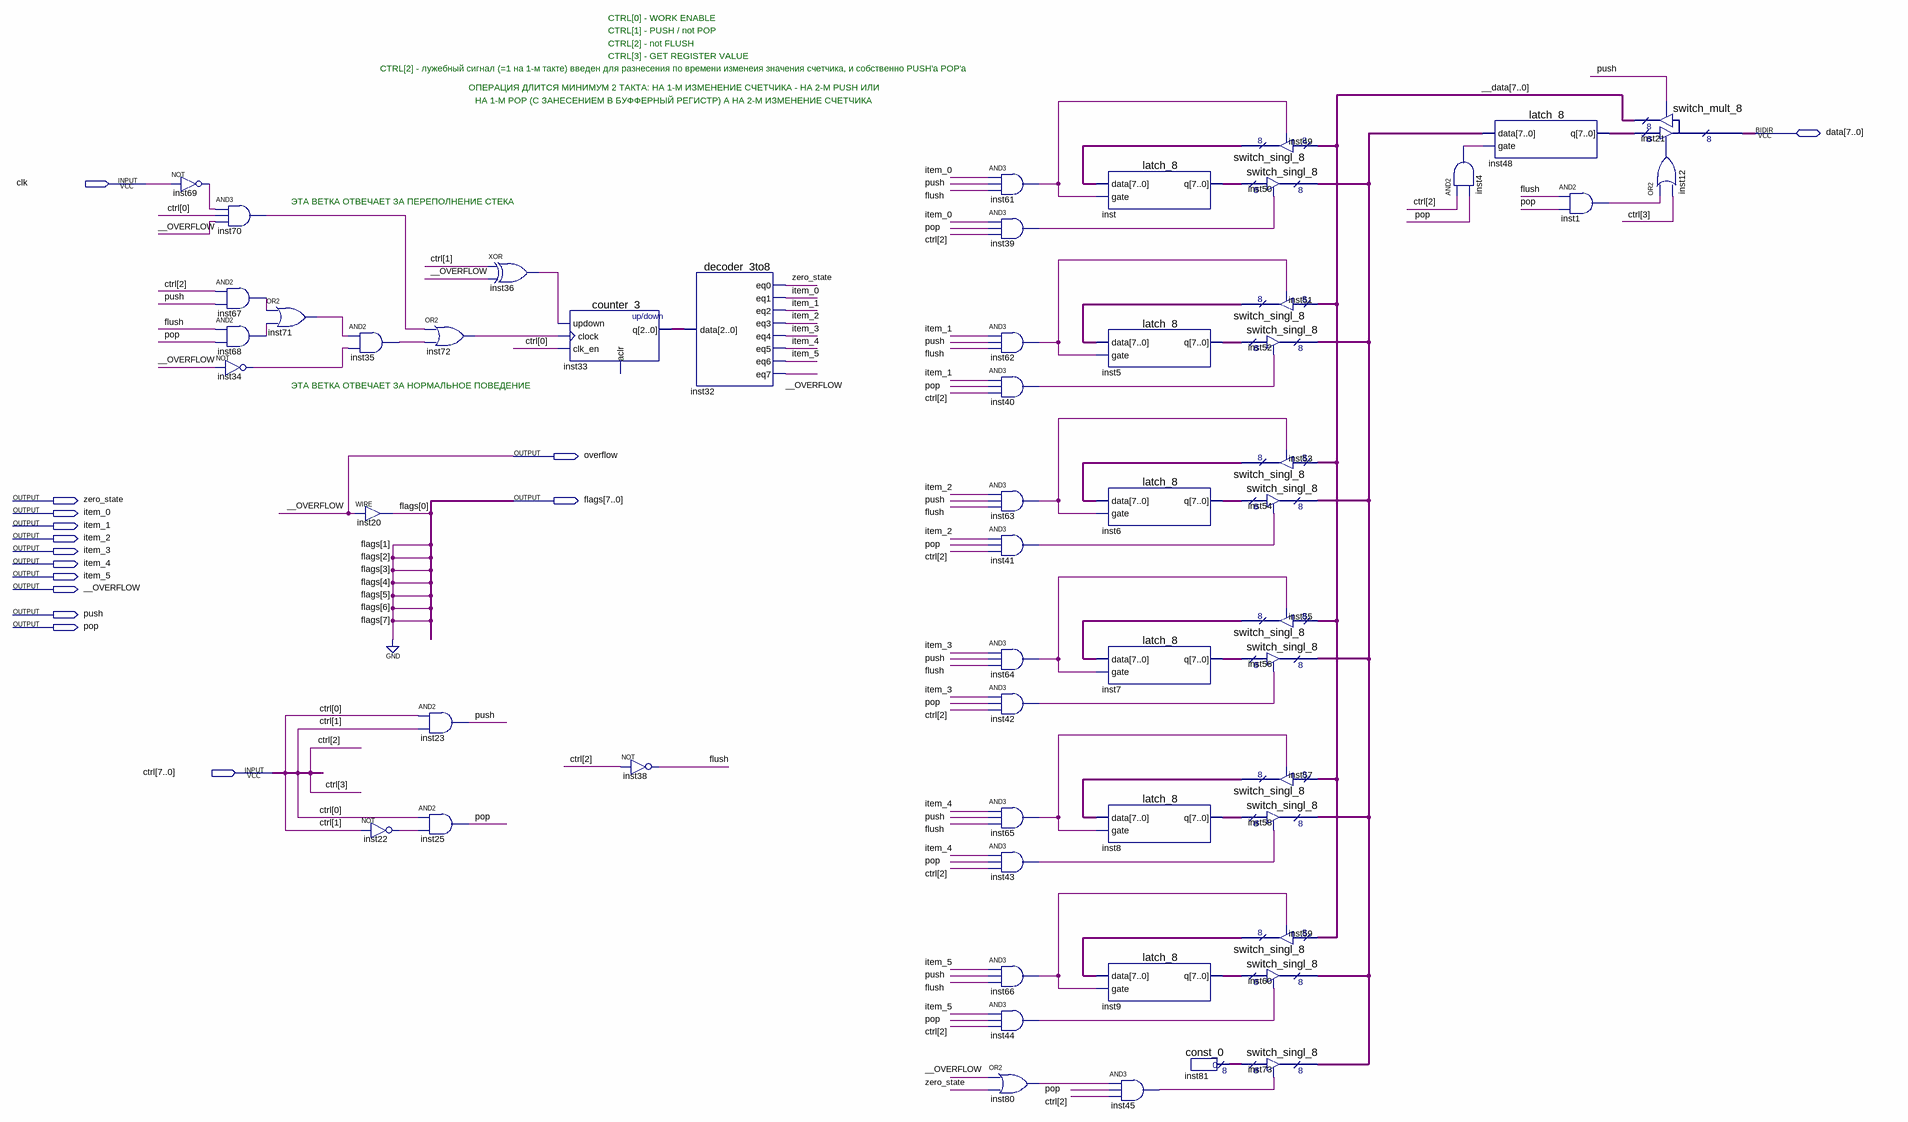
[diagram p0: schematic sheet]
// Quartus schematic stack.bdf as structural Verilog: 55 symbols, 15 pins
module stack (
  input  clk,
  input  [7:0] ctrl,
  inout  [7:0] data,
  output overflow,
  output zero_state,
  output [7:0] flags,
  output item_0,
  output item_1,
  output item_2,
  output item_3,
  output item_4,
  output item_5,
  output __OVERFLOW,
  output push,
  output pop
);

  wire flush, inst1_out, inst4_out, inst12_out, inst22_out, inst34_out, inst35_out, inst36_out, inst39_out,
       inst40_out, inst41_out, inst42_out, inst43_out, inst44_out, inst45_out, inst61_out, inst62_out,
       inst63_out, inst64_out, inst65_out, inst66_out, inst67_out, inst68_out, inst69_out, inst70_out,
       inst71_out, inst72_out, inst80_out;
  wire [2:0] inst33_q;
  wire [7:0] __data, inst5_q, inst6_q, inst7_q, inst8_q, inst9_q, inst48_q, inst49_tridata, inst50_tridata,
       inst51_tridata, inst53_tridata, inst55_tridata, inst57_tridata, inst59_tridata, inst81_result, inst_q;

  not inst69 (inst69_out, clk);
  and inst70 (inst70_out, inst69_out, ctrl[0], __OVERFLOW);
  and inst67 (inst67_out, ctrl[2], push);
  and inst68 (inst68_out, flush, pop);
  not inst34 (inst34_out, __OVERFLOW);
  or inst71 (inst71_out, inst67_out, inst68_out);
  and inst35 (inst35_out, inst71_out, inst34_out);
  assign flags[0] = __OVERFLOW;  // WIRE inst20
  not inst22 (inst22_out, ctrl[1]);
  or inst72 (inst72_out, inst70_out, inst35_out);
  and inst23 (push, ctrl[0], ctrl[1]);
  and inst25 (pop, ctrl[0], inst22_out);
  xor inst36 (inst36_out, ctrl[1], __OVERFLOW);
  counter_3 inst33 (.updown(inst36_out), .clock(inst72_out), .clk_en(ctrl[0]), .q(inst33_q));  // open: aclr
  not inst38 (flush, ctrl[2]);
  decoder_3to8 inst32 (
    .data(inst33_q), .eq0(zero_state), .eq1(item_0), .eq2(item_1), .eq3(item_2), .eq4(item_3), .eq5(item_4),
    .eq6(item_5), .eq7(__OVERFLOW));
  and inst61 (inst61_out, item_0, push, flush);
  and inst39 (inst39_out, item_0, pop, ctrl[2]);
  and inst62 (inst62_out, item_1, push, flush);
  and inst40 (inst40_out, item_1, pop, ctrl[2]);
  and inst63 (inst63_out, item_2, push, flush);
  and inst41 (inst41_out, item_2, pop, ctrl[2]);
  and inst64 (inst64_out, item_3, push, flush);
  and inst42 (inst42_out, item_3, pop, ctrl[2]);
  and inst65 (inst65_out, item_4, push, flush);
  and inst43 (inst43_out, item_4, pop, ctrl[2]);
  and inst66 (inst66_out, item_5, push, flush);
  and inst44 (inst44_out, item_5, pop, ctrl[2]);
  or inst80 (inst80_out, __OVERFLOW, zero_state);
  latch_8 inst (.data(inst49_tridata), .gate(inst61_out), .q(inst_q));
  latch_8 inst5 (.data(inst51_tridata), .gate(inst62_out), .q(inst5_q));
  latch_8 inst6 (.data(inst53_tridata), .gate(inst63_out), .q(inst6_q));
  latch_8 inst7 (.data(inst55_tridata), .gate(inst64_out), .q(inst7_q));
  latch_8 inst8 (.data(inst57_tridata), .gate(inst65_out), .q(inst8_q));
  latch_8 inst9 (.data(inst59_tridata), .gate(inst66_out), .q(inst9_q));
  and inst45 (inst45_out, inst80_out, pop, ctrl[2]);
  const_0 inst81 (.result(inst81_result));
  switch_singl_8 inst49 (.enabledt(inst61_out), .data(__data), .tridata(inst49_tridata));
  switch_singl_8 inst50 (.enabledt(inst39_out), .data(inst_q), .tridata(inst50_tridata));
  switch_singl_8 inst51 (.enabledt(inst62_out), .data(__data), .tridata(inst51_tridata));
  switch_singl_8 inst52 (.enabledt(inst40_out), .data(inst5_q), .tridata(inst50_tridata));
  switch_singl_8 inst53 (.enabledt(inst63_out), .data(__data), .tridata(inst53_tridata));
  switch_singl_8 inst54 (.enabledt(inst41_out), .data(inst6_q), .tridata(inst50_tridata));
  switch_singl_8 inst55 (.enabledt(inst64_out), .data(__data), .tridata(inst55_tridata));
  switch_singl_8 inst56 (.enabledt(inst42_out), .data(inst7_q), .tridata(inst50_tridata));
  switch_singl_8 inst57 (.enabledt(inst65_out), .data(__data), .tridata(inst57_tridata));
  switch_singl_8 inst58 (.enabledt(inst43_out), .data(inst8_q), .tridata(inst50_tridata));
  switch_singl_8 inst59 (.enabledt(inst66_out), .data(__data), .tridata(inst59_tridata));
  switch_singl_8 inst60 (.enabledt(inst44_out), .data(inst9_q), .tridata(inst50_tridata));
  switch_singl_8 inst73 (.enabledt(inst45_out), .data(inst81_result), .tridata(inst50_tridata));
  and inst4 (inst4_out, ctrl[2], pop);
  latch_8 inst48 (.data(inst50_tridata), .gate(inst4_out), .q(inst48_q));
  and inst1 (inst1_out, flush, pop);
  switch_mult_8 inst21 (.enabledt(inst12_out), .data(inst48_q), .enabletr(push), .result(__data), .tridata(data));
  or inst12 (inst12_out, inst1_out, ctrl[3]);

  assign flags[7:1] = {7{1'b0}};
  assign overflow = __OVERFLOW;

  // Notes on the sheet:
  //   CTRL[0] - WORK ENABLE
  //   CTRL[1] - PUSH / not POP
  //   CTRL[2] - not FLUSH
  //   CTRL[3] - GET REGISTER VALUE
  //   CTRL[2] - лужебный сигнал (=1 на 1-м такте) введен для разнесения по времени изменеия значения счетчика, и собственно PUSH'a POP'a
  //   ОПЕРАЦИЯ ДЛИТСЯ МИНИМУМ 2 ТАКТА: НА 1-М ИЗМЕНЕНИЕ СЧЕТЧИКА - НА 2-М PUSH ИЛИ
  //   НА 1-М РОР (С ЗАНЕСЕНИЕМ В БУФФЕРНЫЙ РЕГИСТР) А НА 2-М ИЗМЕНЕНИЕ СЧЕТЧИКА
  //   ЭТА ВЕТКА ОТВЕЧАЕТ ЗА ПЕРЕПОЛНЕНИЕ СТЕКА
  //   ЭТА ВЕТКА ОТВЕЧАЕТ ЗА НОРМАЛЬНОЕ ПОВЕДЕНИЕ
endmodule
